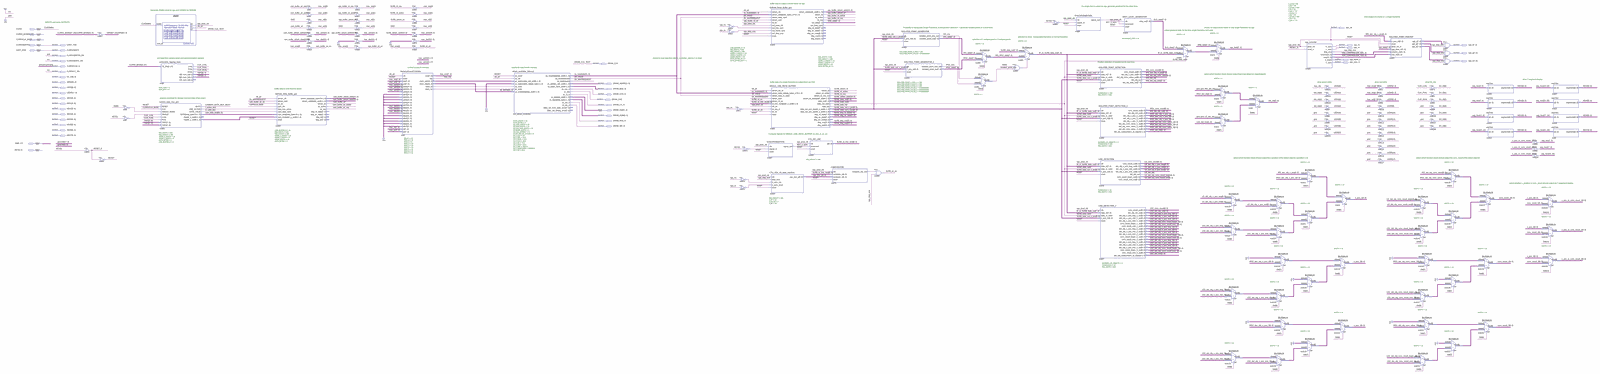
[diagram p0: schematic sheet, whole]
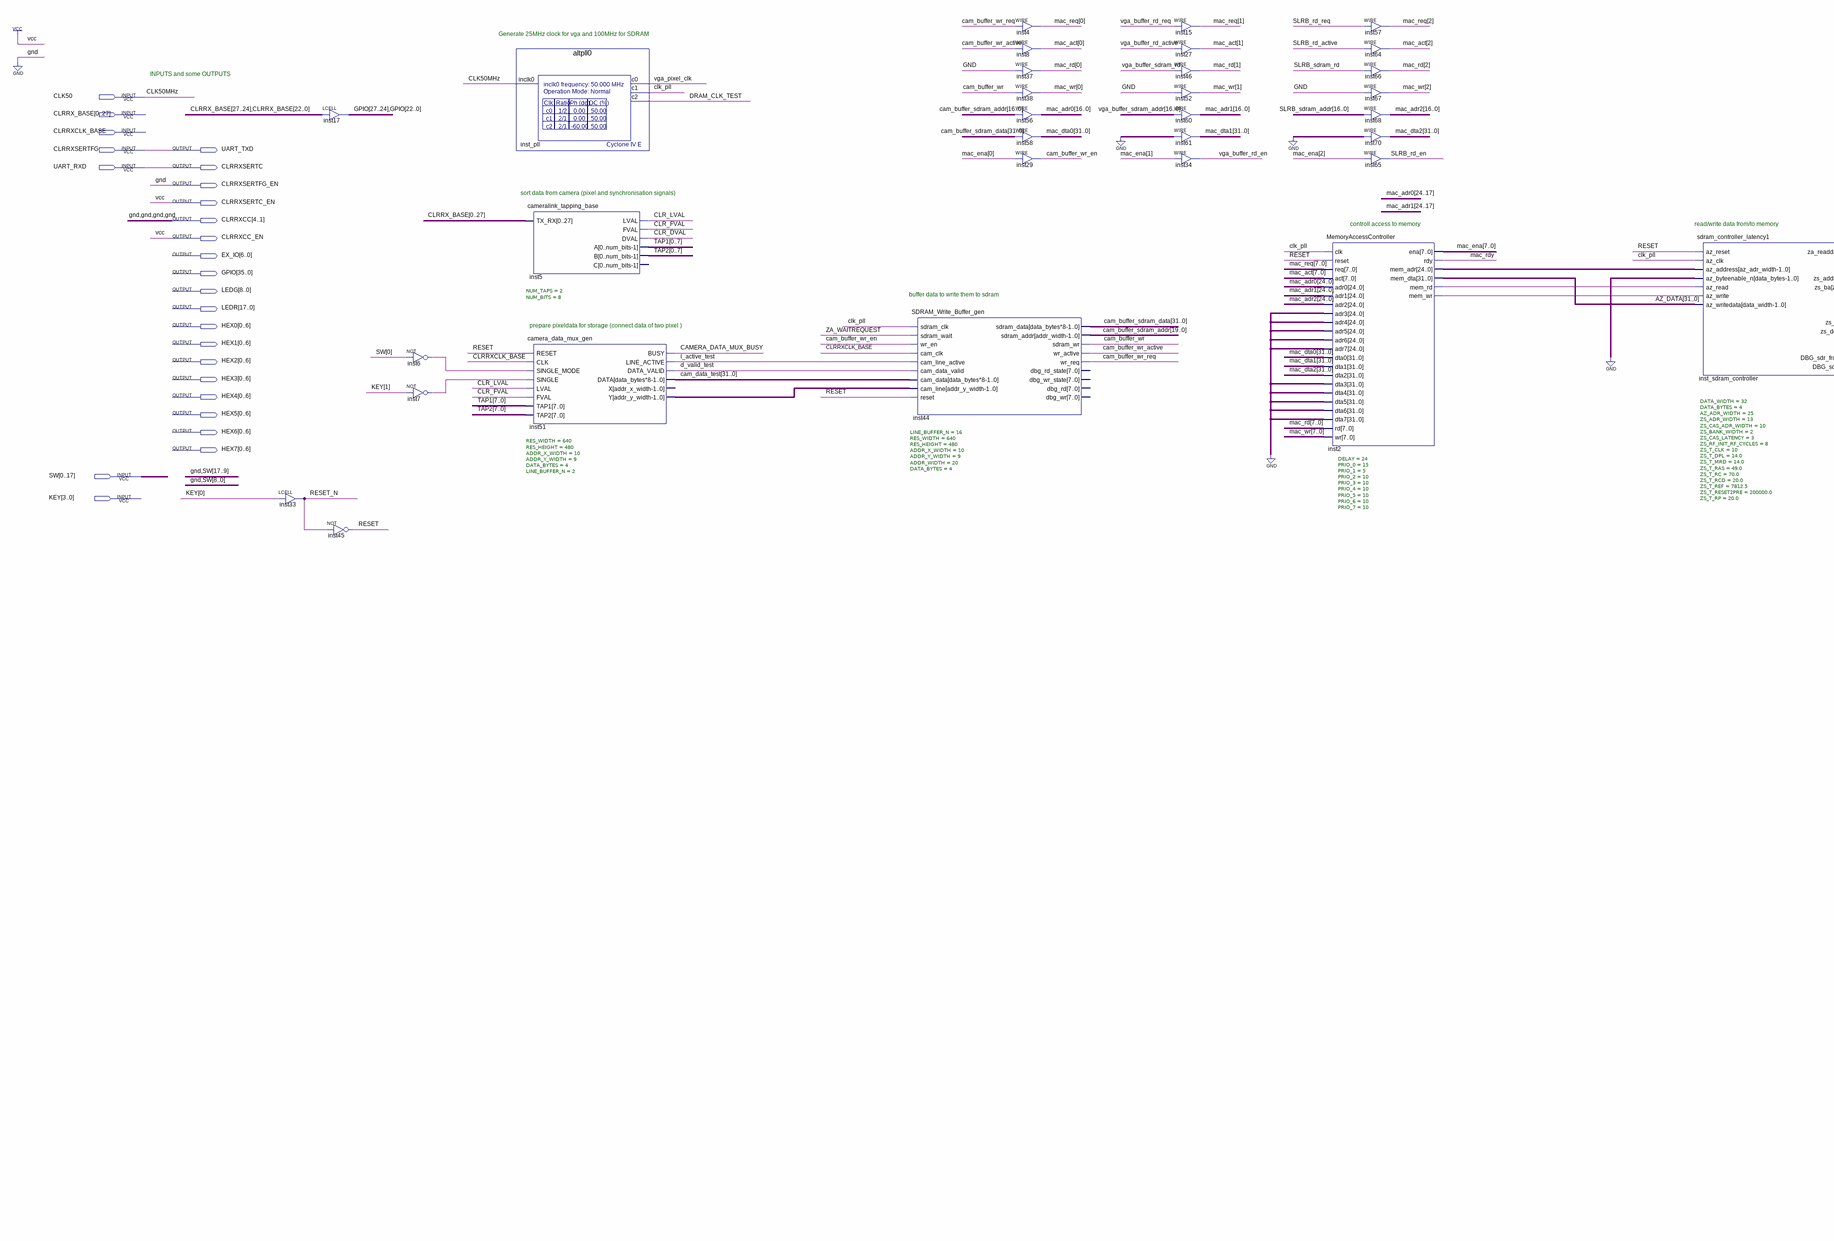
[diagram p1: schematic sheet, left part]
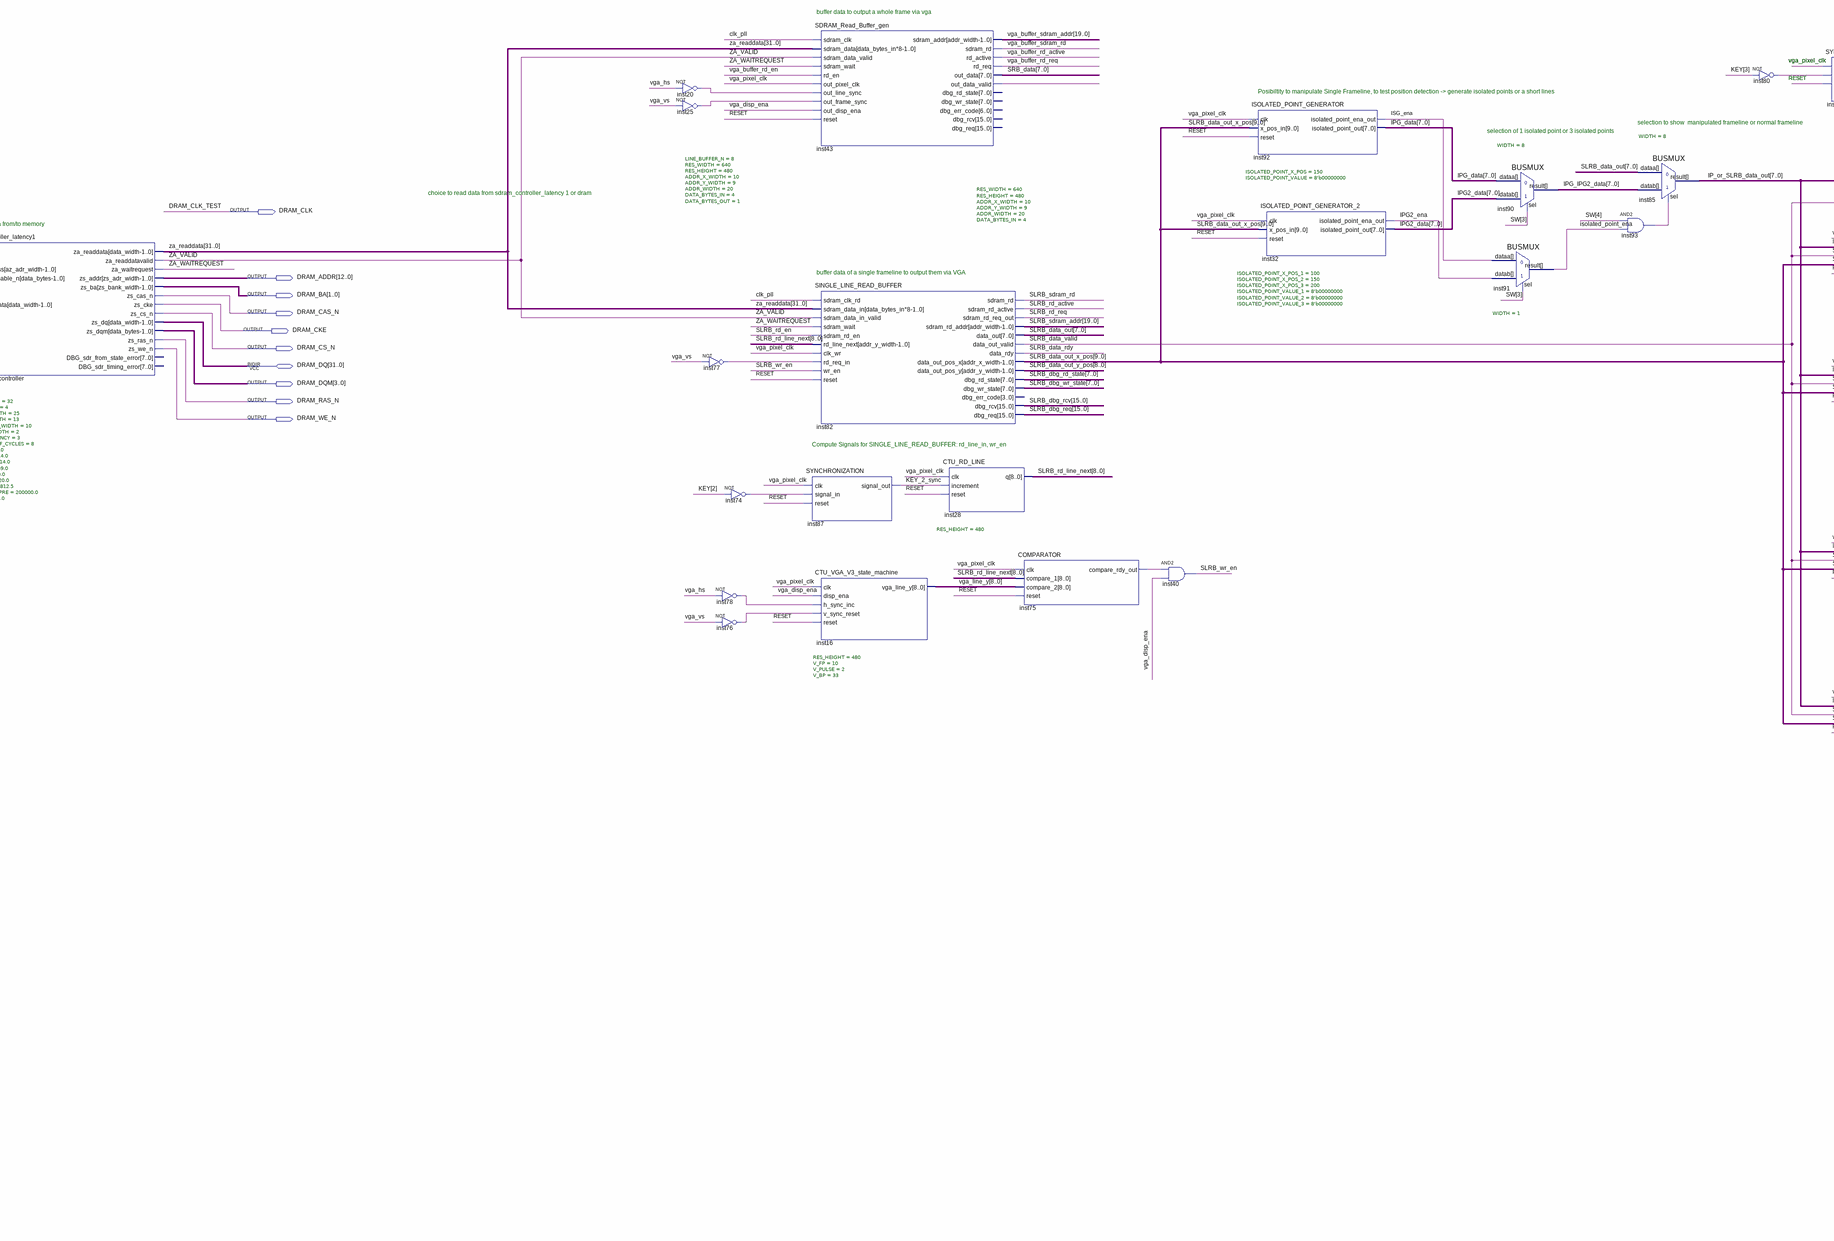
[diagram p2: schematic sheet, centre part]
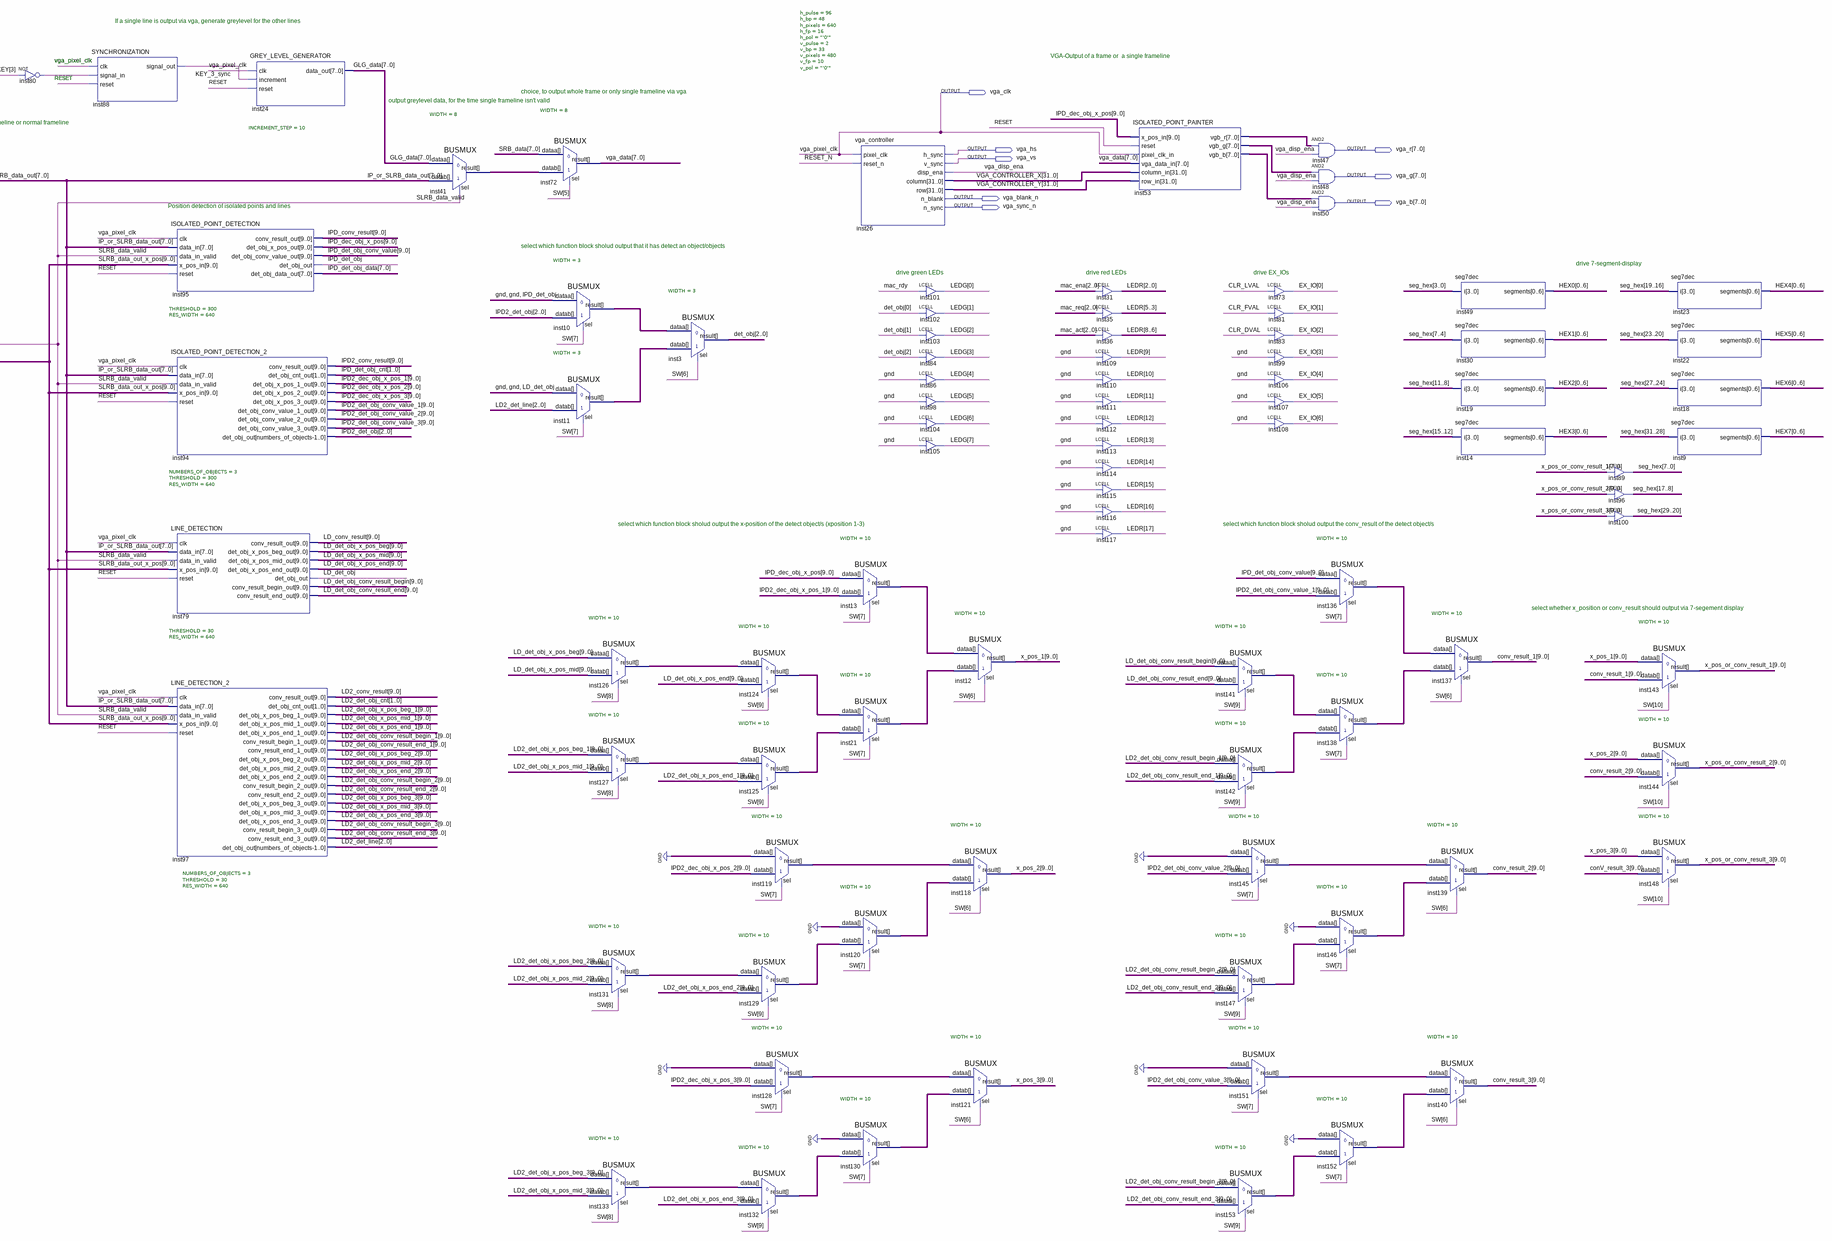
[diagram p3: schematic sheet, right part]
// Quartus schematic sdram-mac.bdf as structural Verilog: 139 symbols, 43 pins
module \sdram-mac  (
  input  CLK50,
  input  [0:27] CLRRX_BASE,
  input  CLRRXCLK_BASE,
  input  CLRRXSERTFG,
  input  UART_RXD,
  input  [0:17] SW,
  input  [3:0] KEY,
  inout  [31:0] DRAM_DQ,
  output vga_clk,
  output UART_TXD,
  output vga_hs,
  output [7:0] vga_r,
  output vga_vs,
  output CLRRXSERTC,
  output [7:0] vga_g,
  output CLRRXSERTFG_EN,
  output vga_blank_n,
  output CLRRXSERTC_EN,
  output [7:0] vga_b,
  output vga_sync_n,
  output DRAM_CLK,
  output [4:1] CLRRXCC,
  output CLRRXCC_EN,
  output [6:0] EX_IO,
  output [35:0] GPIO,
  output [12:0] DRAM_ADDR,
  output [8:0] LEDG,
  output [1:0] DRAM_BA,
  output [17:0] LEDR,
  output DRAM_CAS_N,
  output [0:6] HEX0,
  output DRAM_CKE,
  output [0:6] HEX1,
  output DRAM_CS_N,
  output [0:6] HEX2,
  output [0:6] HEX3,
  output [3:0] DRAM_DQM,
  output [0:6] HEX4,
  output DRAM_RAS_N,
  output [0:6] HEX5,
  output DRAM_WE_N,
  output [0:6] HEX6,
  output [0:6] HEX7
);

  wire cam_buffer_wr, cam_buffer_wr_active, cam_buffer_wr_en, cam_buffer_wr_req, CAMERA_DATA_MUX_BUSY,
       clk_pll, CLR_DVAL, CLR_FVAL, CLR_LVAL, d_valid_test, inst2_mem_rd, inst2_mem_wr, inst6_out, inst7_out,
       inst20_out, inst25_out, inst43_out_data_valid, inst74_out, inst75_compare_rdy_out, inst76_out,
       inst77_out, inst78_out, inst80_out, inst93_out, IPD_det_obj, IPG2_ena, ISG_ena, isolated_point_ena,
       KEY_2_sync, KEY_3_sync, l_active_test, LD_det_obj, mac_rdy, RESET, RESET_N, SLRB_data_rdy,
       SLRB_data_valid, SLRB_rd_active, SLRB_rd_en, SLRB_rd_req, SLRB_sdram_rd, SLRB_wr_en,
       vga_buffer_rd_active, vga_buffer_rd_en, vga_buffer_rd_req, vga_buffer_sdram_rd, vga_disp_ena,
       ZA_VALID, ZA_WAITREQUEST;
  wire [1:0] IPD_det_obj_cnt, LD2_det_obj_cnt;
  wire [2:0] det_obj, inst10_result, inst11_result, IPD2_det_obj, LD2_det_line;
  wire [7:0] GLG_data, inst41_result, inst53_vgb_b, inst53_vgb_g, inst53_vgb_r, IP_or_SLRB_data_out,
       IPD_det_obj_data, IPG2_data, IPG_data, IPG_IPG2_data, mac_act, mac_ena, mac_rd, mac_req, mac_wr,
       SLRB_data_out, SLRB_dbg_rd_state, SLRB_dbg_wr_state, SRB_data, TAP1, TAP2, vga_data;
  wire [8:0] inst51_y, SLRB_data_out_y_pos, SLRB_rd_line_next, vga_line_y;
  wire [9:0] conv_result_1, conv_result_2, conv_result_3, inst13_result, inst21_result, inst119_result,
       inst120_result, inst124_result, inst125_result, inst126_result, inst127_result, inst128_result,
       inst129_result, inst130_result, inst131_result, inst132_result, inst133_result, inst136_result,
       inst138_result, inst141_result, inst142_result, inst145_result, inst146_result, inst147_result,
       inst151_result, inst152_result, inst153_result, IPD2_conv_result, IPD2_dec_obj_x_pos_1,
       IPD2_dec_obj_x_pos_2, IPD2_dec_obj_x_pos_3, IPD2_det_obj_conv_value_1, IPD2_det_obj_conv_value_2,
       IPD2_det_obj_conv_value_3, IPD_conv_result, IPD_dec_obj_x_pos, IPD_det_obj_conv_value,
       LD2_conv_result, LD2_det_obj_conv_result_begin_1, LD2_det_obj_conv_result_begin_2,
       LD2_det_obj_conv_result_begin_3, LD2_det_obj_conv_result_end_1, LD2_det_obj_conv_result_end_2,
       LD2_det_obj_conv_result_end_3, LD2_det_obj_x_pos_beg_1, LD2_det_obj_x_pos_beg_2,
       LD2_det_obj_x_pos_beg_3, LD2_det_obj_x_pos_end_1, LD2_det_obj_x_pos_end_2, LD2_det_obj_x_pos_end_3,
       LD2_det_obj_x_pos_mid_1, LD2_det_obj_x_pos_mid_2, LD2_det_obj_x_pos_mid_3, LD_conv_result,
       LD_det_obj_conv_result_begin, LD_det_obj_conv_result_end, LD_det_obj_x_pos_beg, LD_det_obj_x_pos_end,
       LD_det_obj_x_pos_mid, SLRB_data_out_x_pos, x_pos_1, x_pos_2, x_pos_3, x_pos_or_conv_result_1,
       x_pos_or_conv_result_2, x_pos_or_conv_result_3;
  wire [15:0] SLRB_dbg_rcv, SLRB_dbg_req;
  wire [19:0] cam_buffer_sdram_addr, SLRB_sdram_addr, vga_buffer_sdram_addr;
  wire [24:0] inst2_mem_adr, mac_adr0, mac_adr1, mac_adr2;
  wire [31:0] AZ_DATA, cam_buffer_sdram_data, cam_data_test, mac_dta0, mac_dta1, mac_dta2, seg_hex,
       VGA_CONTROLLER_X, VGA_CONTROLLER_Y, za_readdata;

  LCELL inst33 (.IN(KEY[0]), .OUT(RESET_N));
  LCELL inst17[26:0] (
    .IN({CLRRX_BASE[27], CLRRX_BASE[26], CLRRX_BASE[25], CLRRX_BASE[24], CLRRX_BASE[22], CLRRX_BASE[21], CLRRX_BASE[20], CLRRX_BASE[19], CLRRX_BASE[18], CLRRX_BASE[17], CLRRX_BASE[16], CLRRX_BASE[15], CLRRX_BASE[14], CLRRX_BASE[13], CLRRX_BASE[12], CLRRX_BASE[11], CLRRX_BASE[10], CLRRX_BASE[9], CLRRX_BASE[8], CLRRX_BASE[7], CLRRX_BASE[6], CLRRX_BASE[5], CLRRX_BASE[4], CLRRX_BASE[3], CLRRX_BASE[2], CLRRX_BASE[1], CLRRX_BASE[0]}),
    .OUT({GPIO[27:24], GPIO[22:0]}));
  not inst45 (RESET, RESET_N);
  not inst6 (inst6_out, SW[0]);
  not inst7 (inst7_out, KEY[1]);
  altpll0 inst_pll (.inclk0(CLK50), .c0(vga_clk), .c1(clk_pll), .c2(DRAM_CLK));
  cameralink_tapping_base #(.NUM_TAPS(2), .NUM_BITS(8)) inst5 (
    .TX_RX(CLRRX_BASE), .LVAL(CLR_LVAL), .FVAL(CLR_FVAL), .DVAL(CLR_DVAL),
    .A({TAP1[0], TAP1[1], TAP1[2], TAP1[3], TAP1[4], TAP1[5], TAP1[6], TAP1[7]}),
    .B({TAP2[0], TAP2[1], TAP2[2], TAP2[3], TAP2[4], TAP2[5], TAP2[6], TAP2[7]}));  // open: C
  camera_data_mux_gen #(.RES_WIDTH(640), .RES_HEIGHT(480), .ADDR_X_WIDTH(10), .ADDR_Y_WIDTH(9), .DATA_BYTES(4), .LINE_BUFFER_N(2)) inst51 (
    .RESET(RESET), .CLK(CLRRXCLK_BASE), .SINGLE_MODE(inst6_out), .SINGLE(inst7_out), .LVAL(CLR_LVAL),
    .FVAL(CLR_FVAL), .TAP1(TAP1), .TAP2(TAP2), .BUSY(CAMERA_DATA_MUX_BUSY), .LINE_ACTIVE(l_active_test),
    .DATA_VALID(d_valid_test), .DATA(cam_data_test), .Y(inst51_y));  // open: X
  SDRAM_Write_Buffer_gen #(.LINE_BUFFER_N(16), .RES_WIDTH(640), .RES_HEIGHT(480), .ADDR_X_WIDTH(10), .ADDR_Y_WIDTH(9), .ADDR_WIDTH(20), .DATA_BYTES(4)) inst44 (
    .sdram_clk(clk_pll), .sdram_wait(ZA_WAITREQUEST), .wr_en(cam_buffer_wr_en), .cam_clk(CLRRXCLK_BASE),
    .cam_line_active(l_active_test), .cam_data_valid(d_valid_test), .cam_data(cam_data_test),
    .cam_line(inst51_y), .reset(RESET), .sdram_data(cam_buffer_sdram_data),
    .sdram_addr(cam_buffer_sdram_addr), .sdram_wr(cam_buffer_wr), .wr_active(cam_buffer_wr_active),
    .wr_req(cam_buffer_wr_req));  // open: dbg_rd_state, dbg_wr_state, dbg_rd, dbg_wr
  assign mac_req[0] = cam_buffer_wr_req;  // WIRE inst4
  assign mac_act[0] = cam_buffer_wr_active;  // WIRE inst8
  assign mac_rd[0] = 1'b0;  // WIRE inst37
  assign mac_wr[0] = cam_buffer_wr;  // WIRE inst38
  assign mac_adr0[16:0] = cam_buffer_sdram_addr[16:0];  // WIRE inst56
  assign mac_dta0 = cam_buffer_sdram_data;  // WIRE inst58
  assign cam_buffer_wr_en = mac_ena[0];  // WIRE inst29
  assign mac_req[1] = vga_buffer_rd_req;  // WIRE inst15
  assign mac_act[1] = vga_buffer_rd_active;  // WIRE inst27
  assign mac_rd[1] = vga_buffer_sdram_rd;  // WIRE inst46
  assign mac_wr[1] = 1'b0;  // WIRE inst52
  assign mac_adr1[16:0] = vga_buffer_sdram_addr[16:0];  // WIRE inst60
  assign mac_dta1 = {32{1'b0}};  // WIRE inst61
  assign vga_buffer_rd_en = mac_ena[1];  // WIRE inst34
  MemoryAccessController #(.DELAY(24), .PRIO_0(15), .PRIO_1(5), .PRIO_2(10), .PRIO_3(10), .PRIO_4(10), .PRIO_5(10), .PRIO_6(10), .PRIO_7(10)) inst2 (
    .clk(clk_pll), .reset(RESET), .req(mac_req), .act(mac_act), .adr0(mac_adr0), .adr1(mac_adr1),
    .adr2(mac_adr2), .adr3({32{1'b0}}), .adr4({32{1'b0}}), .adr5({32{1'b0}}), .adr6({32{1'b0}}),
    .adr7({32{1'b0}}), .dta0(mac_dta0), .dta1(mac_dta1), .dta2(mac_dta2), .dta3({32{1'b0}}),
    .dta4({32{1'b0}}), .dta5({32{1'b0}}), .dta6({32{1'b0}}), .dta7({32{1'b0}}), .rd(mac_rd), .wr(mac_wr),
    .ena(mac_ena), .rdy(mac_rdy), .mem_adr(inst2_mem_adr), .mem_dta(AZ_DATA), .mem_rd(inst2_mem_rd),
    .mem_wr(inst2_mem_wr));
  assign mac_req[2] = SLRB_rd_req;  // WIRE inst57
  assign mac_act[2] = SLRB_rd_active;  // WIRE inst64
  assign mac_rd[2] = SLRB_sdram_rd;  // WIRE inst66
  assign mac_wr[2] = 1'b0;  // WIRE inst67
  assign mac_adr2[16:0] = SLRB_sdram_addr[16:0];  // WIRE inst68
  assign mac_dta2 = {32{1'b0}};  // WIRE inst70
  assign SLRB_rd_en = mac_ena[2];  // WIRE inst65
  sdram_controller_latency1 #(.DATA_WIDTH(32), .DATA_BYTES(4), .AZ_ADR_WIDTH(25), .ZS_ADR_WIDTH(13), .ZS_CAS_ADR_WIDTH(10), .ZS_BANK_WIDTH(2), .ZS_CAS_LATENCY(3), .ZS_RF_INIT_RF_CYCLES(8), .ZS_T_CLK(10), .ZS_T_DPL(14.0), .ZS_T_MRD(14.0), .ZS_T_RAS(49.0), .ZS_T_RC(70.0), .ZS_T_RCD(20.0), .ZS_T_REF(7812.5), .ZS_T_RESET2PRE(200000.0), .ZS_T_RP(20.0)) inst_sdram_controller (
    .az_reset(RESET), .az_clk(clk_pll), .az_address(inst2_mem_adr), .az_byteenable_n(4'b0000),
    .az_read(inst2_mem_rd), .az_write(inst2_mem_wr), .az_writedata(AZ_DATA), .za_readdata(za_readdata),
    .za_readdatavalid(ZA_VALID), .za_waitrequest(ZA_WAITREQUEST), .zs_addr(DRAM_ADDR), .zs_ba(DRAM_BA),
    .zs_cas_n(DRAM_CAS_N), .zs_cke(DRAM_CKE), .zs_cs_n(DRAM_CS_N), .zs_dqm(DRAM_DQM), .zs_ras_n(DRAM_RAS_N),
    .zs_we_n(DRAM_WE_N), .zs_dq(DRAM_DQ));  // open: DBG_sdr_from_state_error, DBG_sdr_timing_error
  not inst20 (inst20_out, vga_hs);
  not inst25 (inst25_out, vga_vs);
  not inst77 (inst77_out, vga_vs);
  not inst78 (inst78_out, vga_hs);
  not inst76 (inst76_out, vga_vs);
  not inst74 (inst74_out, KEY[2]);
  SDRAM_Read_Buffer_gen #(.LINE_BUFFER_N(8), .RES_WIDTH(640), .RES_HEIGHT(480), .ADDR_X_WIDTH(10), .ADDR_Y_WIDTH(9), .ADDR_WIDTH(20), .DATA_BYTES_IN(4), .DATA_BYTES_OUT(1)) inst43 (
    .sdram_clk(clk_pll), .sdram_data(za_readdata), .sdram_data_valid(ZA_VALID), .sdram_wait(ZA_WAITREQUEST),
    .rd_en(vga_buffer_rd_en), .out_pixel_clk(vga_clk), .out_line_sync(inst20_out),
    .out_frame_sync(inst25_out), .out_disp_ena(vga_disp_ena), .reset(RESET),
    .sdram_addr(vga_buffer_sdram_addr), .sdram_rd(vga_buffer_sdram_rd), .rd_active(vga_buffer_rd_active),
    .rd_req(vga_buffer_rd_req), .out_data(SRB_data), .out_data_valid(inst43_out_data_valid));  // open: dbg_rd_state, dbg_wr_state, dbg_err_code, dbg_rcv, dbg_req
  SINGLE_LINE_READ_BUFFER #(.RES_WIDTH(640), .RES_HEIGHT(480), .ADDR_X_WIDTH(10), .ADDR_Y_WIDTH(9), .ADDR_WIDTH(20), .DATA_BYTES_IN(4)) inst82 (
    .sdram_clk_rd(clk_pll), .sdram_data_in(za_readdata), .sdram_data_in_valid(ZA_VALID),
    .sdram_wait(ZA_WAITREQUEST), .sdram_rd_en(SLRB_rd_en), .rd_line_next(SLRB_rd_line_next),
    .clk_wr(vga_clk), .rd_req_in(inst77_out), .wr_en(SLRB_wr_en), .reset(RESET), .sdram_rd(SLRB_sdram_rd),
    .sdram_rd_active(SLRB_rd_active), .sdram_rd_req_out(SLRB_rd_req), .sdram_rd_addr(SLRB_sdram_addr),
    .data_out(SLRB_data_out), .data_out_valid(SLRB_data_valid), .data_rdy(SLRB_data_rdy),
    .data_out_pos_x(SLRB_data_out_x_pos), .data_out_pos_y(SLRB_data_out_y_pos),
    .dbg_rd_state(SLRB_dbg_rd_state), .dbg_wr_state(SLRB_dbg_wr_state), .dbg_rcv(SLRB_dbg_rcv),
    .dbg_req(SLRB_dbg_req));  // open: dbg_err_code
  SYNCHRONIZATION inst87 (.clk(vga_clk), .signal_in(inst74_out), .reset(RESET), .signal_out(KEY_2_sync));
  CTU_VGA_V3_state_machine #(.RES_HEIGHT(480), .V_FP(10), .V_PULSE(2), .V_BP(33)) inst16 (
    .clk(vga_clk), .disp_ena(vga_disp_ena), .h_sync_inc(inst78_out), .v_sync_reset(inst76_out),
    .reset(RESET), .vga_line_y(vga_line_y));
  CTU_RD_LINE #(.RES_HEIGHT(480)) inst28 (.clk(vga_clk), .increment(KEY_2_sync), .reset(RESET), .q(SLRB_rd_line_next));
  COMPARATOR inst75 (
    .clk(vga_clk), .compare_1(SLRB_rd_line_next), .compare_2(vga_line_y), .reset(RESET),
    .compare_rdy_out(inst75_compare_rdy_out));
  and inst40 (SLRB_wr_en, inst75_compare_rdy_out, vga_disp_ena);
  ISOLATED_POINT_GENERATOR #(.ISOLATED_POINT_X_POS(150), .ISOLATED_POINT_VALUE(8'b00000000)) inst92 (
    .clk(vga_clk), .x_pos_in(SLRB_data_out_x_pos), .reset(RESET), .isolated_point_ena_out(ISG_ena),
    .isolated_point_out(IPG_data));
  ISOLATED_POINT_GENERATOR_2 #(.ISOLATED_POINT_X_POS_1(100), .ISOLATED_POINT_X_POS_2(150), .ISOLATED_POINT_X_POS_3(200), .ISOLATED_POINT_VALUE_1(8'b00000000), .ISOLATED_POINT_VALUE_2(8'b00000000), .ISOLATED_POINT_VALUE_3(8'b00000000)) inst32 (
    .clk(vga_clk), .x_pos_in(SLRB_data_out_x_pos), .reset(RESET), .isolated_point_ena_out(IPG2_ena),
    .isolated_point_out(IPG2_data));
  BUSMUX #(.WIDTH(1)) inst91 (.datab(IPG2_ena), .sel(SW[3]), .dataa(ISG_ena), .result(isolated_point_ena));
  BUSMUX #(.WIDTH(8)) inst90 (.datab(IPG2_data), .sel(SW[3]), .dataa(IPG_data), .result(IPG_IPG2_data));
  and inst93 (inst93_out, SW[4], isolated_point_ena);
  BUSMUX #(.WIDTH(8)) inst85 (
    .datab(IPG_IPG2_data), .sel(inst93_out), .dataa(SLRB_data_out), .result(IP_or_SLRB_data_out));
  not inst80 (inst80_out, KEY[3]);
  SYNCHRONIZATION inst88 (.clk(vga_clk), .signal_in(inst80_out), .reset(RESET), .signal_out(KEY_3_sync));
  ISOLATED_POINT_DETECTION #(.THRESHOLD(300), .RES_WIDTH(640)) inst95 (
    .clk(vga_clk), .data_in(IP_or_SLRB_data_out), .data_in_valid(SLRB_data_valid),
    .x_pos_in(SLRB_data_out_x_pos), .reset(RESET), .conv_result_out(IPD_conv_result),
    .det_obj_x_pos_out(IPD_dec_obj_x_pos), .det_obj_conv_value_out(IPD_det_obj_conv_value),
    .det_obj_out(IPD_det_obj), .det_obj_data_out(IPD_det_obj_data));
  ISOLATED_POINT_DETECTION_2 #(.NUMBERS_OF_OBJECTS(3), .THRESHOLD(300), .RES_WIDTH(640)) inst94 (
    .clk(vga_clk), .data_in(IP_or_SLRB_data_out), .data_in_valid(SLRB_data_valid),
    .x_pos_in(SLRB_data_out_x_pos), .reset(RESET), .conv_result_out(IPD2_conv_result),
    .det_obj_cnt_out(IPD_det_obj_cnt), .det_obj_x_pos_1_out(IPD2_dec_obj_x_pos_1),
    .det_obj_x_pos_2_out(IPD2_dec_obj_x_pos_2), .det_obj_x_pos_3_out(IPD2_dec_obj_x_pos_3),
    .det_obj_conv_value_1_out(IPD2_det_obj_conv_value_1),
    .det_obj_conv_value_2_out(IPD2_det_obj_conv_value_2),
    .det_obj_conv_value_3_out(IPD2_det_obj_conv_value_3), .det_obj_out(IPD2_det_obj));
  LINE_DETECTION #(.THRESHOLD(30), .RES_WIDTH(640)) inst79 (
    .clk(vga_clk), .data_in(IP_or_SLRB_data_out), .data_in_valid(SLRB_data_valid),
    .x_pos_in(SLRB_data_out_x_pos), .reset(RESET), .conv_result_out(LD_conv_result),
    .det_obj_x_pos_beg_out(LD_det_obj_x_pos_beg), .det_obj_x_pos_mid_out(LD_det_obj_x_pos_mid),
    .det_obj_x_pos_end_out(LD_det_obj_x_pos_end), .det_obj_out(LD_det_obj),
    .conv_result_begin_out(LD_det_obj_conv_result_begin), .conv_result_end_out(LD_det_obj_conv_result_end));
  LINE_DETECTION_2 #(.NUMBERS_OF_OBJECTS(3), .THRESHOLD(30), .RES_WIDTH(640)) inst97 (
    .clk(vga_clk), .data_in(IP_or_SLRB_data_out), .data_in_valid(SLRB_data_valid),
    .x_pos_in(SLRB_data_out_x_pos), .reset(RESET), .conv_result_out(LD2_conv_result),
    .det_obj_cnt_out(LD2_det_obj_cnt), .det_obj_x_pos_beg_1_out(LD2_det_obj_x_pos_beg_1),
    .det_obj_x_pos_mid_1_out(LD2_det_obj_x_pos_mid_1), .det_obj_x_pos_end_1_out(LD2_det_obj_x_pos_end_1),
    .conv_result_begin_1_out(LD2_det_obj_conv_result_begin_1),
    .conv_result_end_1_out(LD2_det_obj_conv_result_end_1), .det_obj_x_pos_beg_2_out(LD2_det_obj_x_pos_beg_2),
    .det_obj_x_pos_mid_2_out(LD2_det_obj_x_pos_mid_2), .det_obj_x_pos_end_2_out(LD2_det_obj_x_pos_end_2),
    .conv_result_begin_2_out(LD2_det_obj_conv_result_begin_2),
    .conv_result_end_2_out(LD2_det_obj_conv_result_end_2), .det_obj_x_pos_beg_3_out(LD2_det_obj_x_pos_beg_3),
    .det_obj_x_pos_mid_3_out(LD2_det_obj_x_pos_mid_3), .det_obj_x_pos_end_3_out(LD2_det_obj_x_pos_end_3),
    .conv_result_begin_3_out(LD2_det_obj_conv_result_begin_3),
    .conv_result_end_3_out(LD2_det_obj_conv_result_end_3), .det_obj_out(LD2_det_line));
  GREY_LEVEL_GENERATOR #(.INCREMENT_STEP(10)) inst24 (
    .clk(vga_clk), .increment(KEY_3_sync), .reset(RESET), .data_out(GLG_data));
  BUSMUX #(.WIDTH(8)) inst41 (
    .datab(IP_or_SLRB_data_out), .sel(SLRB_data_valid), .dataa(GLG_data), .result(inst41_result));
  BUSMUX #(.WIDTH(8)) inst72 (.datab(inst41_result), .sel(SW[5]), .dataa(SRB_data), .result(vga_data));
  BUSMUX #(.WIDTH(3)) inst10 (.datab(IPD2_det_obj), .sel(SW[7]), .dataa({2'b00, IPD_det_obj}), .result(inst10_result));
  BUSMUX #(.WIDTH(3)) inst11 (.datab(LD2_det_line), .sel(SW[7]), .dataa({2'b00, LD_det_obj}), .result(inst11_result));
  BUSMUX #(.WIDTH(10)) inst126 (
    .datab(LD_det_obj_x_pos_mid), .sel(SW[8]), .dataa(LD_det_obj_x_pos_beg), .result(inst126_result));
  BUSMUX #(.WIDTH(10)) inst127 (
    .datab(LD2_det_obj_x_pos_mid_1), .sel(SW[8]), .dataa(LD2_det_obj_x_pos_beg_1), .result(inst127_result));
  BUSMUX #(.WIDTH(10)) inst131 (
    .datab(LD2_det_obj_x_pos_mid_2), .sel(SW[8]), .dataa(LD2_det_obj_x_pos_beg_2), .result(inst131_result));
  BUSMUX #(.WIDTH(10)) inst133 (
    .datab(LD2_det_obj_x_pos_mid_3), .sel(SW[8]), .dataa(LD2_det_obj_x_pos_beg_3), .result(inst133_result));
  BUSMUX #(.WIDTH(3)) inst3 (.datab(inst11_result), .sel(SW[6]), .dataa(inst10_result), .result(det_obj));
  BUSMUX #(.WIDTH(10)) inst124 (
    .datab(LD_det_obj_x_pos_end), .sel(SW[9]), .dataa(inst126_result), .result(inst124_result));
  BUSMUX #(.WIDTH(10)) inst125 (
    .datab(LD2_det_obj_x_pos_end_1), .sel(SW[9]), .dataa(inst127_result), .result(inst125_result));
  BUSMUX #(.WIDTH(10)) inst129 (
    .datab(LD2_det_obj_x_pos_end_2), .sel(SW[9]), .dataa(inst131_result), .result(inst129_result));
  BUSMUX #(.WIDTH(10)) inst132 (
    .datab(LD2_det_obj_x_pos_end_3), .sel(SW[9]), .dataa(inst133_result), .result(inst132_result));
  BUSMUX #(.WIDTH(10)) inst119 (.datab(IPD2_dec_obj_x_pos_2), .sel(SW[7]), .dataa({10{1'b0}}), .result(inst119_result));
  BUSMUX #(.WIDTH(10)) inst128 (.datab(IPD2_dec_obj_x_pos_3), .sel(SW[7]), .dataa({10{1'b0}}), .result(inst128_result));
  vga_controller #(.h_pulse(96), .h_bp(48), .h_pixels(640), .h_fp(16), .h_pol("'0'"), .v_pulse(2), .v_bp(33), .v_pixels(480), .v_fp(10), .v_pol("'0'")) inst26 (
    .pixel_clk(vga_clk), .reset_n(RESET_N), .h_sync(vga_hs), .v_sync(vga_vs), .disp_ena(vga_disp_ena),
    .column(VGA_CONTROLLER_X), .row(VGA_CONTROLLER_Y), .n_blank(vga_blank_n), .n_sync(vga_sync_n));
  BUSMUX #(.WIDTH(10)) inst13 (
    .datab(IPD2_dec_obj_x_pos_1), .sel(SW[7]), .dataa(IPD_dec_obj_x_pos), .result(inst13_result));
  BUSMUX #(.WIDTH(10)) inst21 (.datab(inst125_result), .sel(SW[7]), .dataa(inst124_result), .result(inst21_result));
  BUSMUX #(.WIDTH(10)) inst120 (.datab(inst129_result), .sel(SW[7]), .dataa({10{1'b0}}), .result(inst120_result));
  BUSMUX #(.WIDTH(10)) inst130 (.datab(inst132_result), .sel(SW[7]), .dataa({10{1'b0}}), .result(inst130_result));
  LCELL inst101 (.IN(mac_rdy), .OUT(LEDG[0]));
  LCELL inst102 (.IN(det_obj[0]), .OUT(LEDG[1]));
  LCELL inst103 (.IN(det_obj[1]), .OUT(LEDG[2]));
  LCELL inst84 (.IN(det_obj[2]), .OUT(LEDG[3]));
  LCELL inst86 (.IN(1'b0), .OUT(LEDG[4]));
  LCELL inst98 (.IN(1'b0), .OUT(LEDG[5]));
  LCELL inst104 (.IN(1'b0), .OUT(LEDG[6]));
  LCELL inst105 (.IN(1'b0), .OUT(LEDG[7]));
  BUSMUX #(.WIDTH(10)) inst12 (.datab(inst21_result), .sel(SW[6]), .dataa(inst13_result), .result(x_pos_1));
  BUSMUX #(.WIDTH(10)) inst118 (.datab(inst120_result), .sel(SW[6]), .dataa(inst119_result), .result(x_pos_2));
  BUSMUX #(.WIDTH(10)) inst121 (.datab(inst130_result), .sel(SW[6]), .dataa(inst128_result), .result(x_pos_3));
  LCELL inst31[2:0] (.IN(mac_ena[2:0]), .OUT(LEDR[2:0]));
  LCELL inst35[2:0] (.IN(mac_req[2:0]), .OUT(LEDR[5:3]));
  LCELL inst36[2:0] (.IN(mac_act[2:0]), .OUT(LEDR[8:6]));
  LCELL inst109 (.IN(1'b0), .OUT(LEDR[9]));
  LCELL inst110 (.IN(1'b0), .OUT(LEDR[10]));
  LCELL inst111 (.IN(1'b0), .OUT(LEDR[11]));
  LCELL inst112 (.IN(1'b0), .OUT(LEDR[12]));
  LCELL inst113 (.IN(1'b0), .OUT(LEDR[13]));
  LCELL inst114 (.IN(1'b0), .OUT(LEDR[14]));
  LCELL inst115 (.IN(1'b0), .OUT(LEDR[15]));
  LCELL inst116 (.IN(1'b0), .OUT(LEDR[16]));
  LCELL inst117 (.IN(1'b0), .OUT(LEDR[17]));
  ISOLATED_POINT_PAINTER inst53 (
    .x_pos_in(IPD_dec_obj_x_pos), .reset(RESET), .pixel_clk_in(vga_clk), .vga_data_in(vga_data),
    .column_in(VGA_CONTROLLER_X), .row_in(VGA_CONTROLLER_Y), .vgb_r(inst53_vgb_r), .vgb_g(inst53_vgb_g),
    .vgb_b(inst53_vgb_b));
  BUSMUX #(.WIDTH(10)) inst141 (
    .datab(LD_det_obj_conv_result_end), .sel(SW[9]), .dataa(LD_det_obj_conv_result_begin),
    .result(inst141_result));
  BUSMUX #(.WIDTH(10)) inst142 (
    .datab(LD2_det_obj_conv_result_end_1), .sel(SW[9]), .dataa(LD2_det_obj_conv_result_begin_1),
    .result(inst142_result));
  BUSMUX #(.WIDTH(10)) inst145 (
    .datab(IPD2_det_obj_conv_value_2), .sel(SW[7]), .dataa({10{1'b0}}), .result(inst145_result));
  BUSMUX #(.WIDTH(10)) inst147 (
    .datab(LD2_det_obj_conv_result_end_2), .sel(SW[9]), .dataa(LD2_det_obj_conv_result_begin_2),
    .result(inst147_result));
  BUSMUX #(.WIDTH(10)) inst151 (
    .datab(IPD2_det_obj_conv_value_3), .sel(SW[7]), .dataa({10{1'b0}}), .result(inst151_result));
  BUSMUX #(.WIDTH(10)) inst153 (
    .datab(LD2_det_obj_conv_result_end_3), .sel(SW[9]), .dataa(LD2_det_obj_conv_result_begin_3),
    .result(inst153_result));
  LCELL inst73 (.IN(CLR_LVAL), .OUT(EX_IO[0]));
  LCELL inst81 (.IN(CLR_FVAL), .OUT(EX_IO[1]));
  LCELL inst83 (.IN(CLR_DVAL), .OUT(EX_IO[2]));
  LCELL inst99 (.IN(1'b0), .OUT(EX_IO[3]));
  LCELL inst106 (.IN(1'b0), .OUT(EX_IO[4]));
  LCELL inst107 (.IN(1'b0), .OUT(EX_IO[5]));
  LCELL inst108 (.IN(1'b0), .OUT(EX_IO[6]));
  assign vga_r = inst53_vgb_r & {8{vga_disp_ena}};  // AND2 inst47, 8 bits wide
  assign vga_g = inst53_vgb_g & {8{vga_disp_ena}};  // AND2 inst48, 8 bits wide
  assign vga_b = inst53_vgb_b & {8{vga_disp_ena}};  // AND2 inst50, 8 bits wide
  BUSMUX #(.WIDTH(10)) inst136 (
    .datab(IPD2_det_obj_conv_value_1), .sel(SW[7]), .dataa(IPD_det_obj_conv_value), .result(inst136_result));
  BUSMUX #(.WIDTH(10)) inst138 (.datab(inst142_result), .sel(SW[7]), .dataa(inst141_result), .result(inst138_result));
  BUSMUX #(.WIDTH(10)) inst146 (.datab(inst147_result), .sel(SW[7]), .dataa({10{1'b0}}), .result(inst146_result));
  BUSMUX #(.WIDTH(10)) inst152 (.datab(inst153_result), .sel(SW[7]), .dataa({10{1'b0}}), .result(inst152_result));
  seg7dec inst49 (.i(seg_hex[3:0]), .segments(HEX0));
  seg7dec inst30 (.i(seg_hex[7:4]), .segments(HEX1));
  seg7dec inst19 (.i(seg_hex[11:8]), .segments(HEX2));
  seg7dec inst14 (.i(seg_hex[15:12]), .segments(HEX3));
  BUSMUX #(.WIDTH(10)) inst137 (.datab(inst138_result), .sel(SW[6]), .dataa(inst136_result), .result(conv_result_1));
  BUSMUX #(.WIDTH(10)) inst139 (.datab(inst146_result), .sel(SW[6]), .dataa(inst145_result), .result(conv_result_2));
  BUSMUX #(.WIDTH(10)) inst140 (.datab(inst152_result), .sel(SW[6]), .dataa(inst151_result), .result(conv_result_3));
  LCELL inst89[7:0] (.IN(x_pos_or_conv_result_1[7:0]), .OUT(seg_hex[7:0]));
  LCELL inst96[9:0] (.IN(x_pos_or_conv_result_2), .OUT(seg_hex[17:8]));
  LCELL inst100[9:0] (.IN(x_pos_or_conv_result_3), .OUT(seg_hex[29:20]));
  BUSMUX #(.WIDTH(10)) inst143 (.datab(conv_result_1), .sel(SW[10]), .dataa(x_pos_1), .result(x_pos_or_conv_result_1));
  BUSMUX #(.WIDTH(10)) inst144 (.datab(conv_result_2), .sel(SW[10]), .dataa(x_pos_2), .result(x_pos_or_conv_result_2));
  BUSMUX #(.WIDTH(10)) inst148 (.datab(conv_result_3), .sel(SW[10]), .dataa(x_pos_3), .result(x_pos_or_conv_result_3));
  seg7dec inst23 (.i(seg_hex[19:16]), .segments(HEX4));
  seg7dec inst22 (.i(seg_hex[23:20]), .segments(HEX5));
  seg7dec inst18 (.i(seg_hex[27:24]), .segments(HEX6));
  seg7dec inst9 (.i(seg_hex[31:28]), .segments(HEX7));

  assign CLRRXCC = 4'b0000;
  assign CLRRXCC_EN = 1'b1;
  assign CLRRXSERTC = UART_RXD;
  assign CLRRXSERTC_EN = 1'b1;
  assign CLRRXSERTFG_EN = 1'b0;
  assign UART_TXD = CLRRXSERTFG;

  // Other names for the same wires on the sheet: CLK50MHz = CLK50; DRAM_CLK_TEST = DRAM_CLK; vga_pixel_clk = vga_clk

  // Notes on the sheet:
  //   buffer data to output a whole frame via vga 
  //   If a single line is output via vga, generate greylevel for the other lines
  //   Generate 25MHz clock for vga and 100MHz for SDRAM
  //   VGA-Output of a frame or  a single frameline
  //   vga_pixel_clk
  //   INPUTS and some OUTPUTS
  //   RESET
  //   Posibiltity to manipulate Single Frameline, to test position detection -> generate isolated points or a short lines
  //   choice, to output whole frame or only single frameline via vga
  //   output greylevel data, for the time single frameline isn't valid
  //   selection to show  manipulated frameline or normal frameline
  //   selection of 1 isolated point or 3 isolated points
  //   sort data from camera (pixel and synchronisation signals)
  //   choice to read data from sdram_controller_latency 1 or dram
  //   Position detection of isolated points and lines
  //   controll access to memory
  //   read/write data from/to memory
  //   select which function block sholud output that it has detect an object/objects
  //   drive 7-segment-display
  //   buffer data of a single frameline to output them via VGA
  //   drive green LEDs
  //   drive red LEDs
  //   drive EX_IOs
  //   buffer data to write them to sdram
  //   prepare pixeldata for storage (connect data of two pixel )
  //   Compute Signals for SINGLE_LINE_READ_BUFFER: rd_line_in, wr_en
  //   select which function block sholud output the x-position of the detect object/s (xposition 1-3)
  //   select which function block sholud output the conv_result of the detect object/s
  //   select whether x_position or conv_result should output via 7-segement display
endmodule
